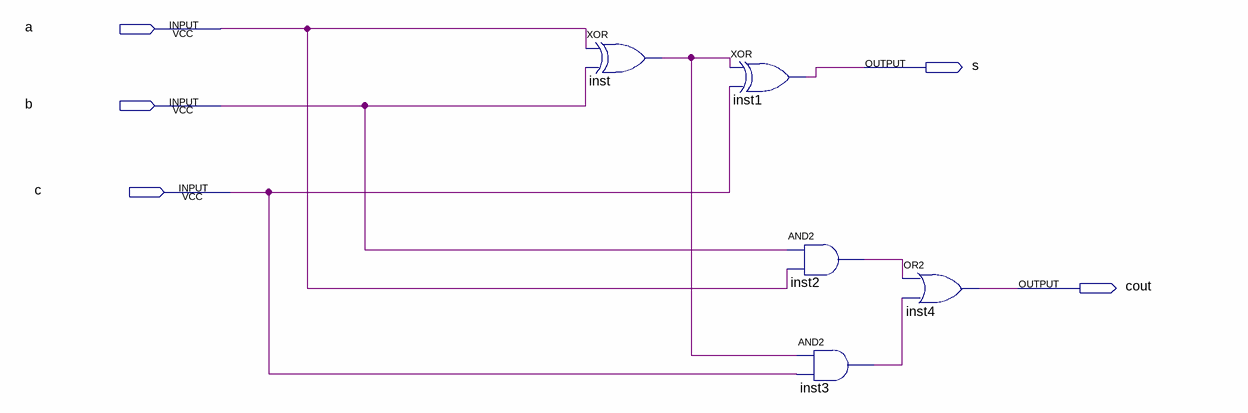
[diagram p0: schematic sheet]
// Quartus schematic 1bit_adder.bdf as structural Verilog: 5 symbols, 5 pins
module \1bit_adder  (
  input  a,
  input  b,
  input  c,
  output s,
  output cout
);

  wire inst2_out, inst3_out, inst_out;

  xor inst (inst_out, a, b);
  xor inst1 (s, inst_out, c);
  and inst2 (inst2_out, b, a);
  and inst3 (inst3_out, inst_out, c);
  or inst4 (cout, inst2_out, inst3_out);
endmodule
